# EAGLE design GPSsd1.1 (EAGLE 9.6.2)
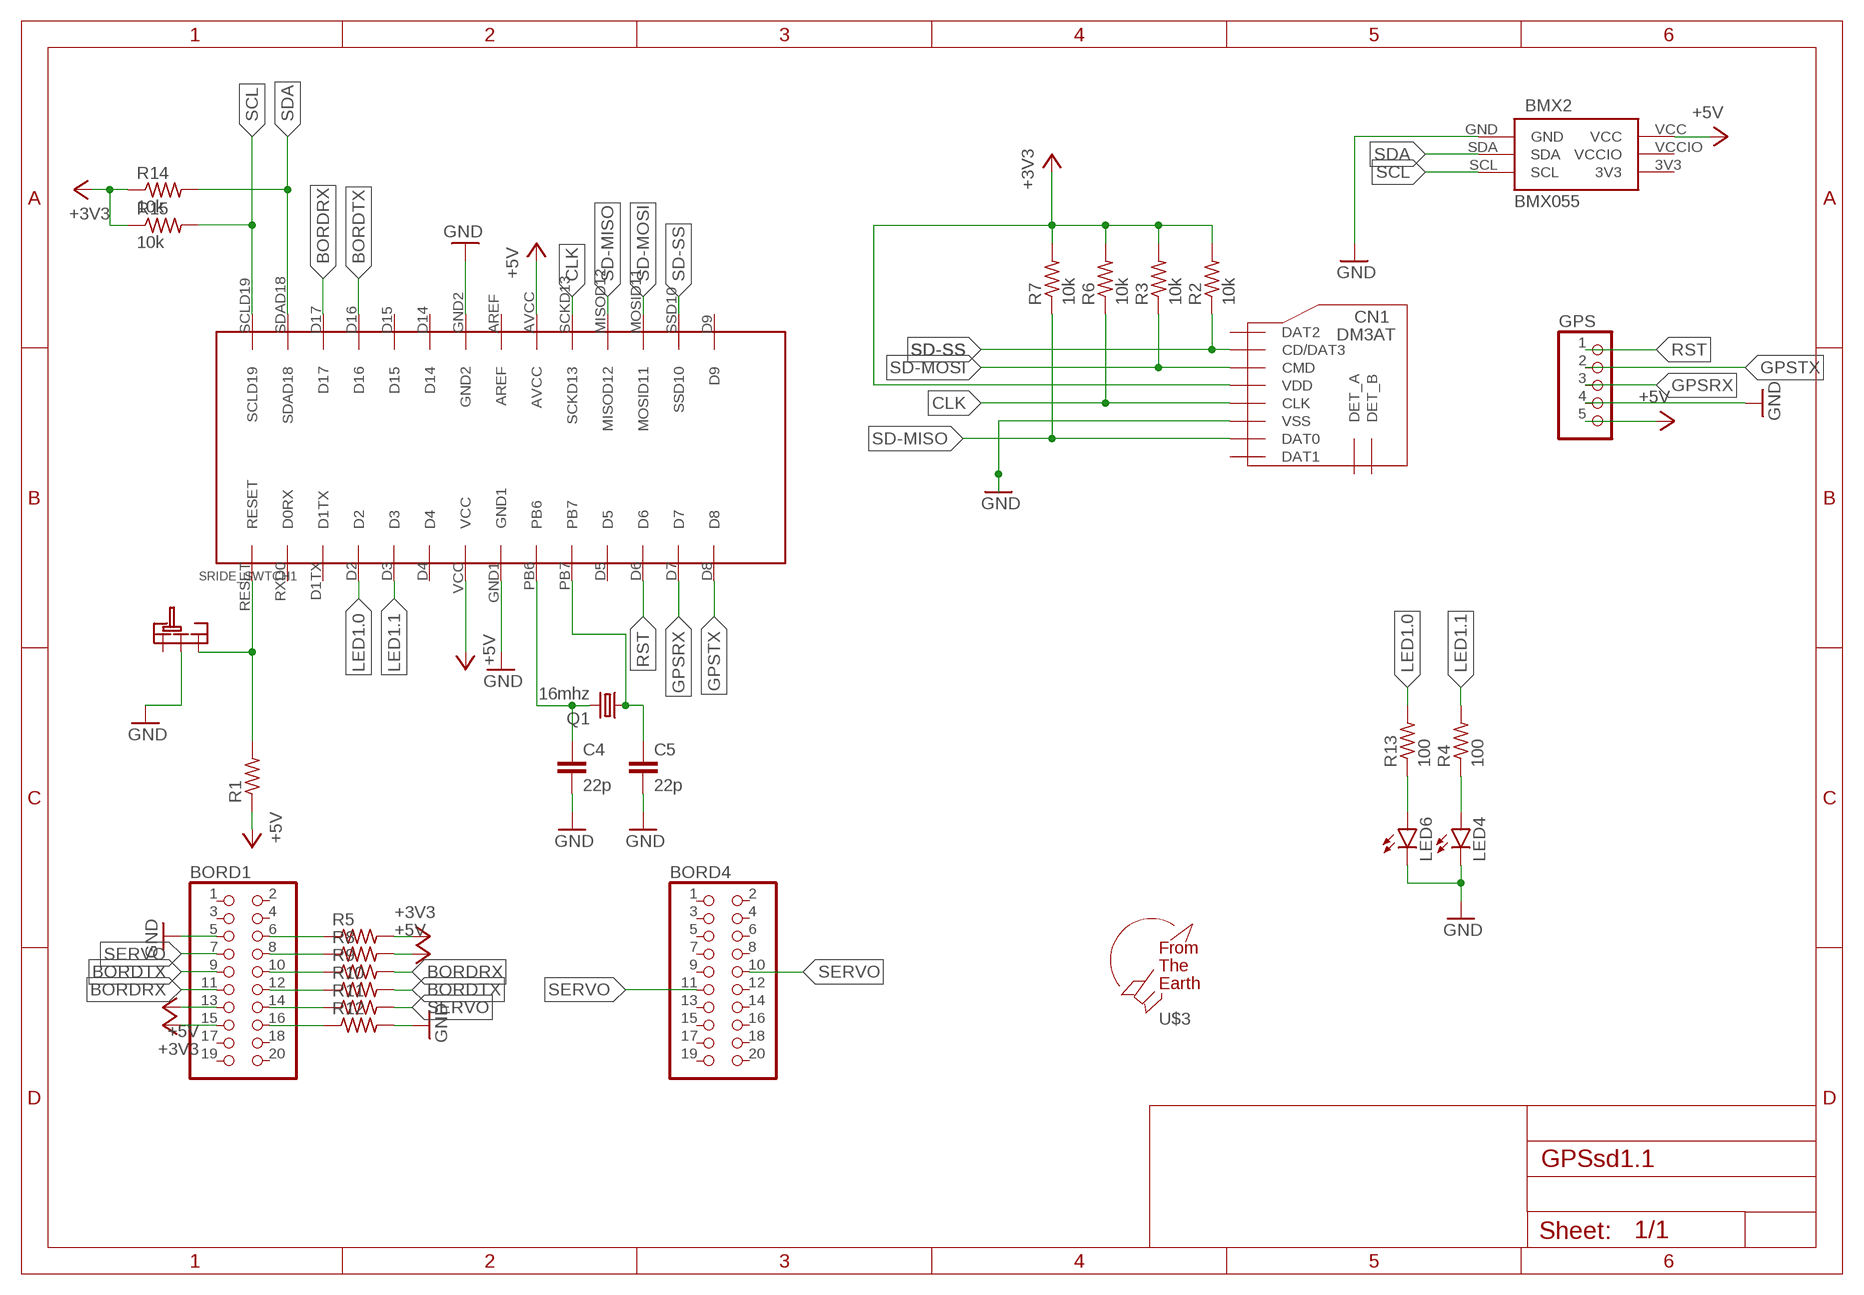
[diagram p0: schematic, sheet 1]

## Parts
BMX2  BMX055  [BMX055]
BORD1  PINHD-2X10/90  [2X10/90]
BORD4  PINHD-2X10/90  [2X10/90]
C4  22p  C-EU025-024X044  [C025-024X044]
C5  22p  C-EU025-024X044  [C025-024X044]
CN1  DM3AT  [DM3AT]
GPS  PINHD-1X55X2MM  [1_05X2MM]
LED4  LED5MM  [LED5MM]
LED6  LED5MM  [LED5MM]
Q1  16mhz  CRYSTALHC49S  [HC49/S]
R1  R-US_0204/7  [0204/7]
R2  10k  R-US_0204/7  [0204/7]
R3  10k  R-US_0204/7  [0204/7]
R4  100  R-US_0204/7  [0204/7]
R5  R-US_0204/7  [0204/7]
R6  10k  R-US_0204/7  [0204/7]
R7  10k  R-US_0204/7  [0204/7]
R8  R-US_0204/7  [0204/7]
R9  R-US_0204/7  [0204/7]
R10  R-US_0204/7  [0204/7]
R11  R-US_0204/7  [0204/7]
R12  R-US_0204/7  [0204/7]
R13  100  R-US_0204/7  [0204/7]
R14  10k  R-US_0204/7  [0204/7]
R15  10k  R-US_0204/7  [0204/7]
SRIDE_SWTCH1  SRIDE_SWITCH  [SRIDE_SWITCH]
U$1  ATMEGA238P  [ATMEGA328P]
U$3  F.T.E.LOGO  [LOGO]

## Nets
+3V3: BORD1.15 CN1.VDD R2.2 R3.2 R5.2 R6.2 R7.2 R14.1 R15.1
+5V [POWER_H]: BMX2.VCC BORD1.13 GPS.5 R1.1 R8.2 U$1.AVCC U$1.VCC
BORDRX: BORD1.11 R9.2 U$1.D17
BORDTX: BORD1.9 R10.2 U$1.D16
CLK: CN1.CLK R6.1 U$1.SCKD13
GND: BMX2.GND BORD1.5 C4.2 C5.2 CN1.VSS GPS.4 LED4.K(C) LED6.K(C) R12.2 SRIDE_SWTCH1.LR U$1.GND1 U$1.GND2
GPSRX: GPS.3 U$1.D7
GPSTX: GPS.2 U$1.D8
LED1.0: R13.2 U$1.D2
LED1.1: R4.2 U$1.D3
N$1: LED6.A R13.1
N$2: BORD1.6 R5.1
N$3: BORD1.8 R8.1
N$4: BORD1.10 R9.1
N$5: C5.1 Q1.1 U$1.PB7
N$6: R1.2 SRIDE_SWTCH1.R U$1.RESET
N$7: C4.1 Q1.2 U$1.PB6
N$8: BORD1.12 R10.1
N$9: BORD1.14 R11.1
N$10: BORD1.16 R12.1
N$11: LED4.A R4.1
RST: GPS.1 U$1.D6
SCL: BMX2.SCL R15.2 U$1.SCLD19
SD-MISO: CN1.DAT0 R7.1 U$1.MISOD12
SD-MOSI: CN1.CMD R3.1 U$1.MOSID11
SD-SS: CN1.CD/DAT3 R2.1 U$1.SSD10
SDA: BMX2.SDA R14.2 U$1.SDAD18
SERVO: BORD1.7 BORD4.10 BORD4.11 R11.2
Unconnected: BORD1.1 BORD1.2 BORD1.3 BORD1.4 BORD1.17 BORD1.18 BORD1.19 BORD1.20 BORD4.1 BORD4.2 BORD4.3 BORD4.4 BORD4.5 BORD4.6 BORD4.7 BORD4.8 BORD4.9 BORD4.12 BORD4.13 BORD4.14 BORD4.15 BORD4.16 BORD4.17 BORD4.18 BORD4.19 BORD4.20 CN1.DAT1 CN1.DAT2 CN1.DET_A CN1.DET_B SRIDE_SWTCH1.L U$1.AREF U$1.D1TX U$1.D4 U$1.D5 U$1.D9 U$1.D14 U$1.D15 U$1.RXD0(D0RX)

## Power pins joined to a net without a drawn wire
3V3: BMX2.3V3
VCCIO: BMX2.VCCIO

## Library data of the parts
BMX2 = BMX055:BMX055
BORD1 BORD4 = pinhead:PINHD-2X10: PIN HEADER
C4 C5 = rcl:C-EU: CAPACITOR, European symbol; SPICEPREFIX: C
CN1 = microSD:DM3AT
GPS = pinhead:PINHD-1X5: PIN HEADER
LED4 LED6 = led:LED: LED OSRAM: - CHIPLED LG R971, LG N971, LY N971, LG Q971, LY Q971, LO R971, LY R971 LH N974, LH R974 LS Q976, LO Q976, LY Q976 LO Q996 - Hyper CHIPLED LW Q18S LB Q993, LB Q99A, LB R99A - SideLED LS A670, LO A670, LY A670, LG A670, LP A670 LB A673, LV A673, LT A673, LW A673 LH A674 LY A675 LS A676, LA A676, LO A676, LY A676, LW A676 LS A679, LY A679, LG A679 - Hyper Micro SIDELED® LS Y876, LA Y876, LO Y876, LY Y876 LT Y87S - SmartLED LW L88C, LW L88S LB L89C, LB L89S, LG L890 LS L89K, LO L89K, LY L89K LS L896, LA L896, LO L896, LY L896 - TOPLED LS T670, LO T670, LY T670, LG T670, LP T670 LSG T670, LSP T670, LSY T670, LOP T670, LYG T670 LG T671, LOG T671, LSG T671 LB T673, LV T673, LT T673, LW T673 LH T674 LS T676, LA T676, LO T676, LY T676, LB T676, LH T676, LSB T676, LW T676 LB T67C, LV T67C, LT T67C, LS T67K, LO T67K, LY T67K, LW E67C LS E67B, LA E67B, LO E67B, LY E67B, LB E67C, LV E67C, LT E67C LW T67C LS T679, LY T679, LG T679 LS T770, LO T770, LY T770, LG T770, LP T770 LB T773, LV T773, LT T773, LW T773 LH T774 LS E675, LA E675, LY E675, LS T675 LS T776, LA T776, LO T776, LY T776, LB T776 LHGB T686 LT T68C, LB T68C - Hyper Mini TOPLED® LB M676 - Mini TOPLED Santana® LG M470 LS M47K, LO M47K, LY M47K Source: http://www.osram.convergy.de LUXEON: - LUMILED® LXK2-PW12-R00, LXK2-PW12-S00, LXK2-PW14-U00, LXK2-PW14-V00 LXK2-PM12-R00, LXK2-PM12-S00, LXK2-PM14-U00 LXK2-PE12-Q00, LXK2-PE12-R00, LXK2-PE12-S00, LXK2-PE14-T00, LXK2-PE14-U00 LXK2-PB12-K00, LXK2-PB12-L00, LXK2-PB12-M00, LXK2-PB14-N00, LXK2-PB14-P00, LXK2-PB14-Q00 LXK2-PR12-L00, LXK2-PR12-M00, LXK2-PR14-Q00, LXK2-PR14-R00 LXK2-PD12-Q00, LXK2-PD12-R00, LXK2-PD12-S00 LXK2-PH12-R00, LXK2-PH12-S00 LXK2-PL12-P00, LXK2-PL12-Q00, LXK2-PL12-R00 Source: www.luxeon.com KINGBRIGHT: KA-3528ASYC Source: www.kingbright.com
Q1 = crystal:CRYSTAL: CRYSTAL; OC_FARNELL: 1667008; OC_NEWARK: unknown
R1-R15 = rcl:R-US_: RESISTOR, American symbol; SPICEPREFIX: R
SRIDE_SWTCH1 = Sride Switch:SRIDE_SWITCH
U$1 = atmega328p:ATMEGA238P
U$3 = logo:F.T.E.LOGO

## Net classes
1 POWER_H: width 0.457 mm, drill 0.152 mm, clearance 0.152 mm

## Board
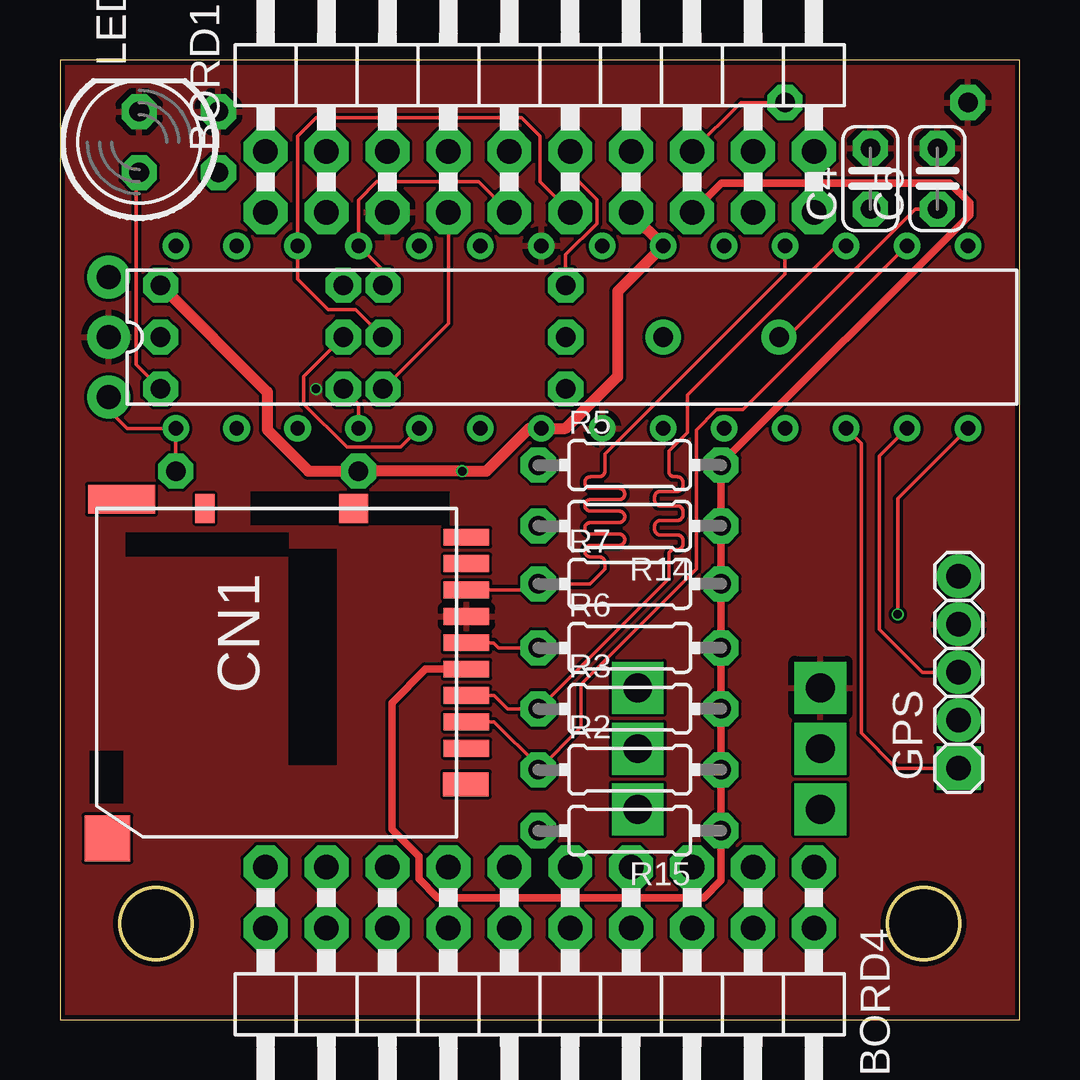
[diagram p1: board, top side]
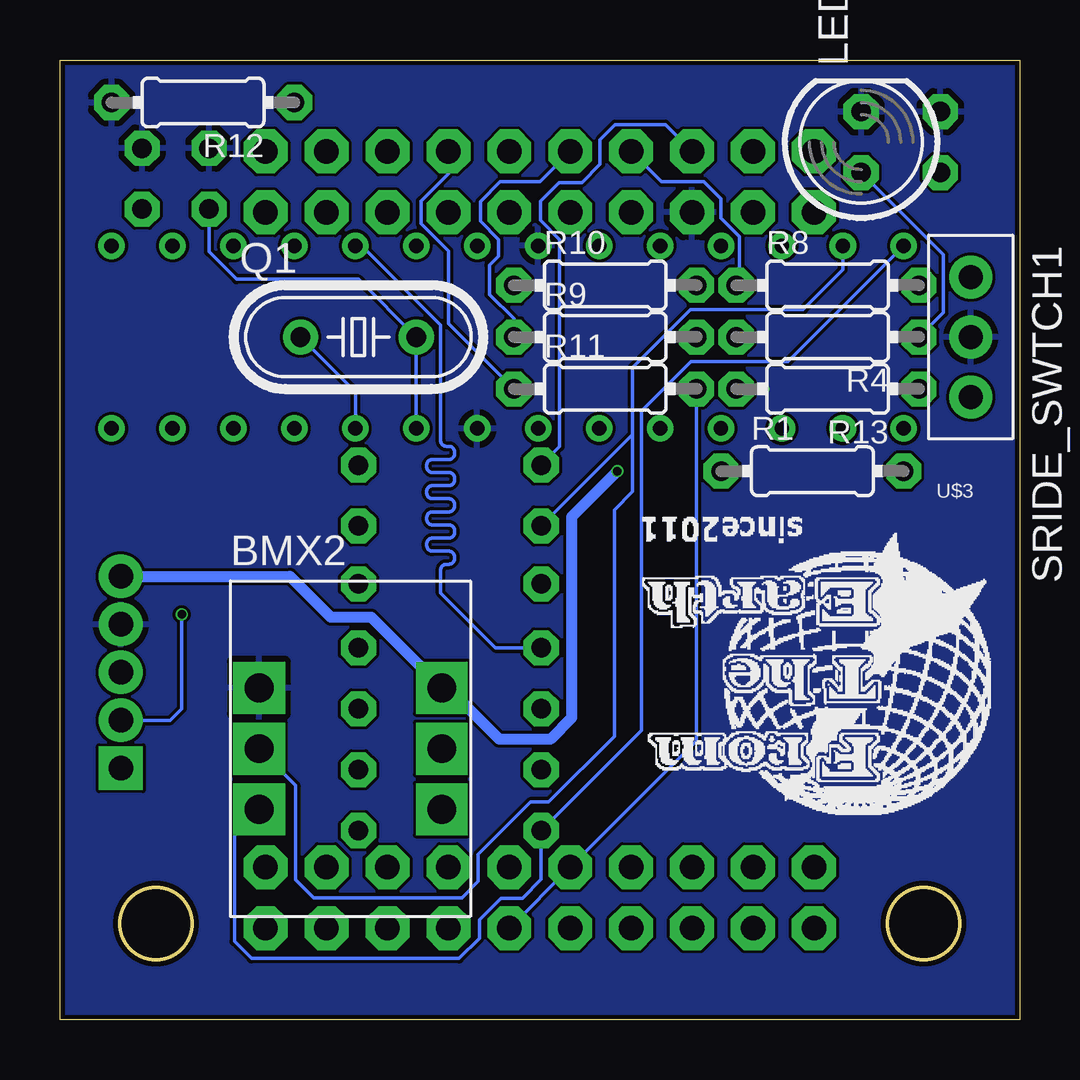
[diagram p2: board, bottom side, seen from below]

Size 40 x 40 mm. Coordinates in mm from the lower left corner, seen from the top.
Outline: 0,0 40,0 40,40 0,40 0,0
Outline: circle at 4,4 radius 1.5
Outline: circle at 36,4 radius 1.5
Copper layers (1*16): Top 0.035mm / dielectric 1.6mm / Bottom 0.035mm
Design rules "jlcpcb-2layers": minimum track width 5mil, minimum drill 0.3mm, track to track 5mil, track to pad 5mil, pad to pad 5mil, via to via 5mil, smd to smd 5mil, copper to edge 0.2mm, drill to drill 6mil, minimum pad ring 10mil, minimum via ring 3mil, stop-mask expansion 4mil, vias tented up to drill 0mil, thermal gap 10mil

### Footprints (pad centres in the part's own frame; a part is rotated, then mirrored left to right if it is on the bottom)
BMX055 = drill 1.2 pad 1.5 square: 3V3 8.81,-9.53; GND 1.19,-4.46; SCL 1.19,-9.53; SDA 1.19,-7; VCC 8.81,-4.46; VCCIO 8.81,-7
2X10/90 = drill 1.016 octagon: 1 -11.43,-6.35; 2 -11.43,-3.81; 3 -8.89,-6.35; 4 -8.89,-3.81; 5 -6.35,-6.35; 6 -6.35,-3.81; 7 -3.81,-6.35; 8 -3.81,-3.81; 9 -1.27,-6.35; 10 -1.27,-3.81; 11 1.27,-6.35; 12 1.27,-3.81; 13 3.81,-6.35; 14 3.81,-3.81; 15 6.35,-6.35; 16 6.35,-3.81; 17 8.89,-6.35; 18 8.89,-3.81; 19 11.43,-6.35; 20 11.43,-3.81
C025-024X044 = drill 0.813 octagon: 1 -1.27,0; 2 1.27,0
DM3AT = smd 0.7 x 1.9: CD/DAT3 2.2,6.4; CLK -1.1,6.4; CMD 1.1,6.4; DAT0 -3.3,6.4; DAT1 -4.4,6.4; DAT2 3.3,6.4; DET_B -5.5,6.4; VDD 0,6.4; VSS -2.2,6.4 | smd 1.2 x 0.8: DET_A -6.7,-4.5 | smd 1 x 1.9: P$9 4.8,6.381 | smd 1.2 x 1.2: P$11 -6.7,1.7 | smd 1.2 x 2.8: P$13 -7.081,-7.973 | smd 1.9 x 1.9: P$14 7.054,-8.562
1_05X2MM = drill 1.016 pad 1.3 square: 1 -4,0 | drill 1.016 pad 1.3: 2 -2,0; 3 0,0; 4 2,0; 5 4,0
LED5MM = drill 0.813 octagon: A -1.27,0; K 1.27,0
HC49/S = drill 0.813: 1 -2.413,0; 2 2.413,0
0204/7 = drill 0.813 octagon: 1 -3.81,0; 2 3.81,0
SRIDE_SWITCH = drill 1: L -2.5,0; LR 0,0; R 2.5,0
ATMEGA328P = drill 0.6: AREF 17.78,7.62; AVCC 20.32,7.62; D1TX 5.08,0; D2 7.62,0; D3 10.16,0; D4 12.7,0; D5 25.4,0; D6 27.94,0; D7 30.48,0; D8 33.02,0; D9 33.02,7.62; D14 12.7,7.62; D15 10.16,7.62; D16 7.62,7.62; D17 5.08,7.62; GND1 17.78,0; GND2 15.24,7.62; MISOD12 25.4,7.62; MOSID11 27.94,7.62; PB6 20.32,0; PB7 22.86,0; RESET 0,0; RXD0 2.54,0; SCKD13 22.86,7.62; SCLD19 0,7.62; SDAD18 2.54,7.62; SSD10 30.48,7.62; VCC 15.24,0

### Placement (x,y rotation side)
BMX2  32.89,18.29 0 bottom
BORD1  20,40 0 top
BORD4  20,0 180 top
C4  33.78,35.05 90 top
C5  36.58,35.05 90 top
CN1  10.54,14.61 270 top
GPS  37.47,14.48 90 top
LED4  6.6,36.58 90 bottom
LED6  3.3,36.58 90 top
Q1  27.56,28.45 0 bottom
R1  8.64,22.86 0 bottom
R2  23.75,10.41 0 top
R3  23.75,12.95 0 top
R4  8,28.45 180 bottom
R5  23.75,23.11 0 top
R6  23.75,15.49 0 top
R7  23.75,18.16 0 top
R8  8,30.61 0 bottom
R9  17.27,28.45 0 bottom
R10  17.27,30.61 0 bottom
R11  17.27,26.29 0 bottom
R12  34.04,38.23 180 bottom
R13  8,26.29 180 bottom
R14  23.75,20.57 180 top
R15  23.75,7.87 180 top
SRIDE_SWTCH1  2.03,28.45 270 bottom
U$1  4.83,24.64 0 top
U$3  0.64,22.35 180 bottom

### Tracks (layer width: path | path; a pad name or v marks a point on that pad's centre or on a via)
+3V3
  Top 0.305: CN1.VDD 15.24,14.61 13.84,13.21 13.84,7.92 14.97,6.79 14.97,5.86 15.75,5.08 26.84,5.08 27.56,5.8 R15.1 R2.2 R3.2 R6.2 R7.2 R14.1 R5.2 27.56,23.17 37.92,33.53 37.92,34.05 37.1,34.87 27.57,34.87 BORD1.15
+5V  (via drill 0.35)
  Top 0.457: BORD1.13 23.81,33.59 U$1.AVCC 23.24,30.35 23.24,26.8 21.08,24.64 U$1.VCC 19.56,24.64 17.78,22.86 v16.76,22.86 R1.1 10.36,22.86 8.64,24.59 8.64,26.16 R8.2
  Bottom 0.457: v16.76,22.86 18.67,20.95 18.67,12.57 19.56,11.68 21.68,11.68 23.83,13.83 BMX2.VCC 27.02,16.76 28.7,16.76 30.42,18.48 GPS.5
BORDRX
  Top 0.152: R9.2 12.32,29.59 11.18,29.59 9.91,30.86 U$1.D17 9.91,36.83 10.67,37.59 19.23,37.59 20,36.83 20,34.92 BORD1.11
BORDTX
  Top 0.152: R10.2 13.46,31.24 U$1.D16 12.45,34.16 13.21,34.92 17.45,34.92 BORD1.9
CLK
  Top 0.152: CN1.CLK 18.08,15.71 18.29,15.49 R6.1
  Bottom 0.152: R6.1 21.84,15.49 24.13,17.78 24.13,18.74 arc90 23.89,18.98 23.78,18.98 arc-90 23.55,19.21 23.55,19.29 arc-90 23.78,19.52 24.48,19.52 arc90 24.71,19.76 24.71,19.84 arc90 24.48,20.07 23.78,20.07 arc-90 23.55,20.31 23.55,20.38 arc-90 23.78,20.62 24.48,20.62 arc90 24.71,20.85 24.71,20.93 arc90 24.48,21.16 23.78,21.16 arc-90 23.55,21.4 23.55,21.48 arc-90 23.78,21.71 24.48,21.71 arc90 24.71,21.95 24.71,22.02 arc90 24.48,22.26 23.78,22.26 arc-90 23.55,22.49 23.55,22.57 arc-90 23.78,22.8 24.48,22.8 arc90 24.71,23.04 24.71,23.11 arc90 24.48,23.35 23.78,23.35 arc-90 23.55,23.58 23.55,23.66 arc-90 23.78,23.89 23.89,23.89 arc90 24.13,24.13 24.13,28.96 27.43,32.26 U$1.SCKD13
GND  (via drill 0.35)
  other vias: 10.67,26.29
  pour Top: 43.18,-27.94 -50.8,-27.94 -97.79,19.05 -97.79,60.96 -52.07,106.68 24.13,106.68 76.2,54.61 76.2,3.81 44.45,-27.94
  pour Bottom: -52.07,-27.94 -99.06,19.05 -99.06,59.69 -52.07,106.68 24.13,106.68 76.2,54.61 76.2,3.81 45.72,-26.67 -52.07,-26.67
GPSRX
  Top 0.152: U$1.D7 34.16,23.5 34.16,16.26 35.94,14.48 GPS.3
GPSTX  (via drill 0.35)
  Top 0.152: U$1.D8 34.92,21.72 v34.92,16.89
  Bottom 0.152: GPS.2 35.4,12.48 34.92,12.95 v34.92,16.89
LED1.0
  Top 0.152: R13.2 12.45,25.65 U$1.D2
LED1.1
  Top 0.152: R4.2 10.16,26.8 10.16,25.65 11.96,23.86 14.2,23.86 U$1.D3
N$1
  Top 0.152: LED6.A 3.17,35.18 3.17,27.3 R13.1
N$2
  Bottom 0.152: BORD1.6 14.76,37.31 16.85,37.31 17.48,36.68 17.48,35.65 18.24,34.9 19.19,34.9 19.98,34.11 19.98,33.31 19.18,32.52 19.18,23.88 R5.1
N$3
  Bottom 0.152: BORD1.8 14.92,34.92 13.15,34.92 12.45,34.22 12.45,33.4 11.68,32.64 11.68,30.73 R8.1
N$4
  Bottom 0.152: R9.1 21.08,29.21 22.1,30.23 22.1,31.44 21.72,31.82 21.72,32.52 22.48,33.27 22.48,34.09 21.65,34.92 20,34.92 BORD1.10
N$5
  Top 0.152: Q1.1 29.99,28.43 30.3,28.43 35.65,33.78 C5.1
  Bottom 0.152: U$1.PB7 27.69,26.16 Q1.1
N$6
  Top 0.152: R1.2 U$1.RESET 2.79,24.64 2.03,25.4 SRIDE_SWTCH1.R
N$7
  Bottom 0.152: U$1.PB6 Q1.2 27.56,30.86 32.64,30.86 33.78,32 C4.1
N$8
  Top 0.152: BORD1.12 21.27,35.3 22.39,34.19 22.39,33.18 21.08,31.88 R10.1
N$9
  Bottom 0.152: R11.1 23.81,29.02 23.81,32.03 24.95,33.18 24.95,34.12 23.81,35.27 BORD1.14
N$10
  Top 0.152: BORD1.16 28.39,38.23 R12.1
N$11
  Bottom 0.152: R4.1 3.17,29.46 3.17,31.88 LED4.A
RST
  Top 0.152: U$1.D6 33.4,24 33.4,11.94 34.86,10.48 GPS.1
SCL
  Bottom 0.152: BMX2.SCL 32.72,7.74 32.72,3.25 32.01,2.55 23.36,2.55 22.52,3.39 22.52,4.15 21.61,5.05 20.73,5.05 19.94,5.84 R15.2 15.77,12.04 15.77,25.37 13.7,27.43 9.65,27.43 U$1.SCLD19
SD-MISO
  Top 0.152: CN1.DAT0 19.68,17.91 R7.1 22.1,18.16 22.71,18.77 22.71,19.05 arc90 22.48,19.29 22.11,19.29 arc-90 21.88,19.52 21.88,19.53 arc-90 22.11,19.76 23.31,19.76 arc90 23.55,20 23.55,20 arc90 23.31,20.24 22.11,20.24 arc-90 21.88,20.48 21.88,20.48 arc-90 22.11,20.72 23.31,20.72 arc90 23.55,20.95 23.55,20.96 arc90 23.31,21.19 22.11,21.19 arc-90 21.88,21.43 21.88,21.44 arc-90 22.11,21.67 23.31,21.67 arc90 23.55,21.91 23.55,21.91 arc90 23.31,22.15 22.11,22.15 arc-90 21.88,22.38 21.88,22.39 arc-90 22.11,22.62 22.48,22.62 arc90 22.71,22.86 22.71,23.57 30.23,31.08 U$1.MISOD12
SD-MOSI
  Top 0.152: CN1.CMD 18.1,13.51 18.65,12.95 R3.1 25.38,18.39 25.38,19.36 arc-90 25.61,19.59 25.73,19.59 arc90 25.97,19.83 25.97,19.96 arc90 25.73,20.2 25.02,20.2 arc-90 24.79,20.43 24.79,20.57 arc-90 25.02,20.8 25.73,20.8 arc90 25.97,21.04 25.97,21.18 arc90 25.73,21.41 25.02,21.41 arc-90 24.79,21.65 24.79,21.78 arc-90 25.02,22.02 25.73,22.02 arc90 25.97,22.25 25.97,22.39 arc90 25.73,22.62 25.61,22.62 arc-90 25.38,22.86 25.38,23.69 26.16,24.48 26.16,26.04 32.38,32.26 U$1.MOSID11
SD-SS
  Top 0.152: CN1.CD/DAT3 18.1,12.4 19.94,10.56 R2.1 21.72,12.19 21.72,13.97 26.52,18.77 26.52,24.58 27.36,25.42 28.47,25.42 U$1.SSD10
SDA
  Bottom 0.152: BMX2.SDA 30.18,9.76 30.18,5.83 29.43,5.08 23.24,5.08 22.57,5.75 22.57,6.89 20.39,9.06 19.64,9.06 16.89,11.81 16.89,21.25 16.13,22.01 16.13,24.38 | U$1.SDAD18 7.37,31.25 9.03,29.59 13.72,29.59 16.13,27.18 16.13,24.38 | R14.2 16.13,24.38
SERVO
  Top 0.152: R11.2 16.19,29.02 BORD1.7
  Bottom 0.152: BORD4.10 BORD4.11 13.46,11.62 R11.2